# Altium project AnalogAndPWM.PrjPcb
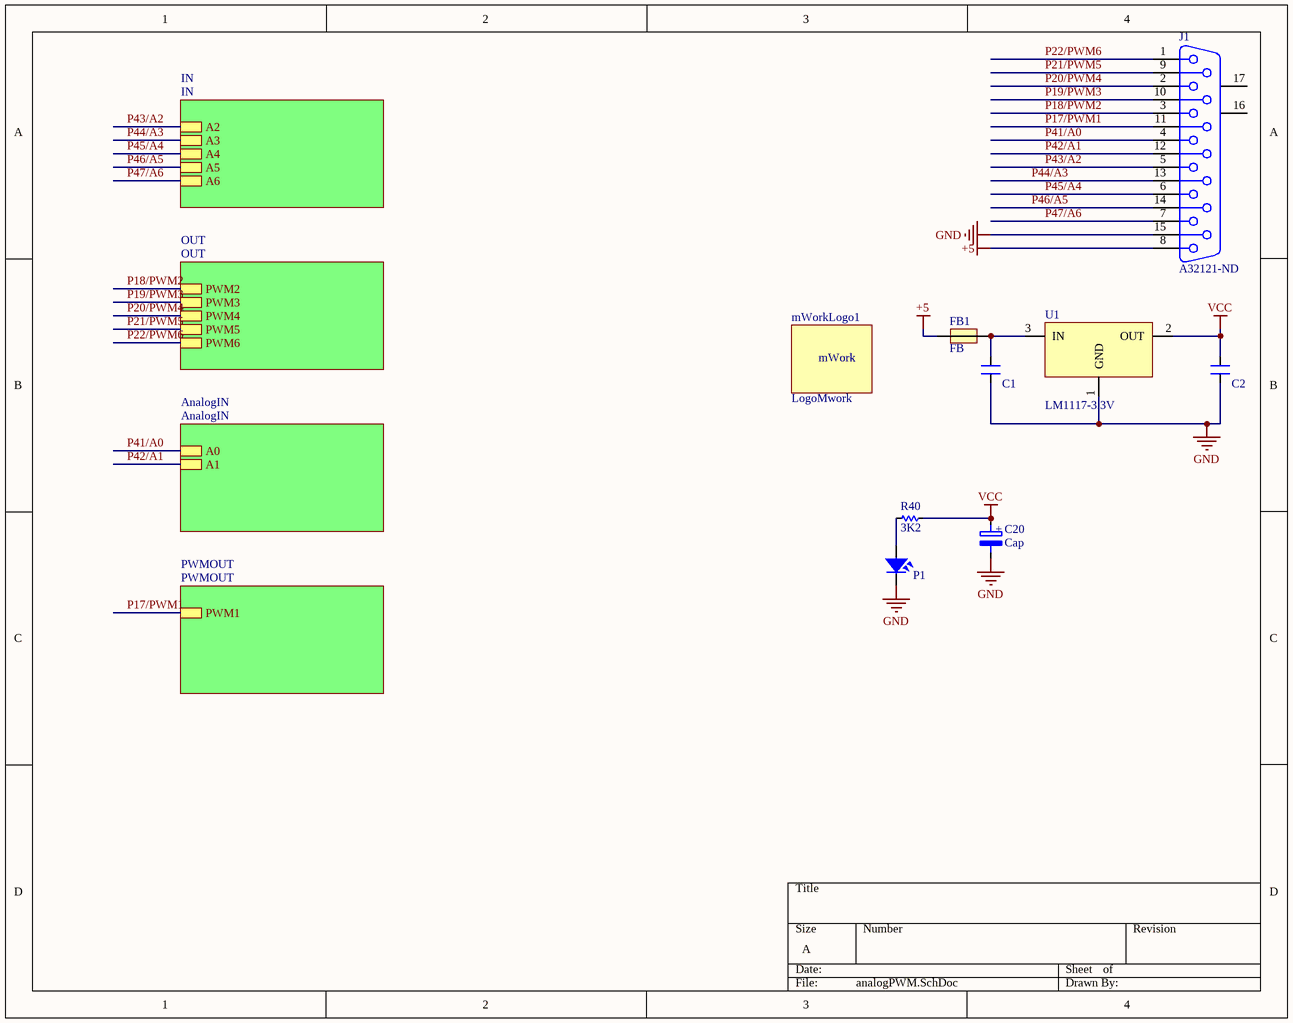
[diagram p0: analogPWM.SchDoc]
5 sheets, 107 parts. Net scope: hierarchical (ports join the sheet entries above them; power ports are global).
Board file: ioPWM.PcbDoc
Sheets:
  analogPWM.SchDoc
    OUT = OUT.SchDoc
    IN = IN.SchDoc
    AnalogIN = AnalogIN.SchDoc
    PWMOUT = PWMOUT.SchDoc

## Sheet analogPWM.SchDoc
size A

### Parts
C1  100nF  [CN-SMD-0805]  (value not drawn)
C2  100nF  [CN-SMD-0805]  (value not drawn)
C20  Cap  [Cap_C]
FB1  FB  [Capacitor_805]
J1  A32121-ND  [DB15]
mWorkLogo1  LogoMwork  [LogoMwork15*6]
P1  LED  [LED-0805-Green]  (value not drawn)
R40  3K2  [RES-SMD-0805]
U1  LM1117-3.3V  [SOT223]

### Sub-sheets
AnalogIN = AnalogIN: A0, A1
IN = IN: A2, A3, A4, A5, A6
OUT = OUT: PWM2, PWM3, PWM4, PWM6, PWM5
PWMOUT = PWMOUT: PWM1

### Nets
+5: FB1.1 J1.8
GND: C1.2 C2.2 C20.2 J1.15 P1.2 U1.1(GND)
VCC: C2.1 C20.1 R40.1 U1.2(OUT)
P17/PWM1: J1.11 ; sheet PWMOUT/PWM1
P18/PWM2: J1.3 ; sheet OUT/PWM2
P19/PWM3: J1.10 ; sheet OUT/PWM3
P20/PWM4: J1.2 ; sheet OUT/PWM4
P21/PWM5: J1.9 ; sheet OUT/PWM5
P22/PWM6: J1.1 ; sheet OUT/PWM6
P41/A0: J1.4 ; sheet AnalogIN/A0
P42/A1: J1.12 ; sheet AnalogIN/A1
P43/A2: J1.5 ; sheet IN/A2
P44/A3: J1.13 ; sheet IN/A3
P45/A4: J1.6 ; sheet IN/A4
P46/A5: J1.14 ; sheet IN/A5
P47/A6: J1.7 ; sheet IN/A6
NetC1_1: C1.1 FB1.2 U1.3(IN)
NetP1_1: P1.1 R40.2

Not connected (* = marked no-connect by the designer): J1 16(MH1) 17(MH2)

### Notes on the sheet
- (in symbol Cap_tan) +
- (in symbol LogoMwork) mWork

### Library data of the parts
C1 C2 = CN: Value: 33pF
C20 = Cap_tan: Polarized Capacitor (Radial)
J1 = DB15: Receptacle Assembly, 15 Position, Right Angle; PackageDocument: O; Positions: 15; Published: 15-Jun-2001; LatestRevisionDate: 17-Jul-2002; LatestRevisionNote: Re-released for DXP Platform.; DatasheetDocument: 1-Sep-99; PackageReference: 788757; Publisher: Altium Limited; Orientation: Right Angle; Gender: Receptacle
P1 = LED SMD: Value: LED 3 - 5 ly 2 Colour
R40 = R
U1 = LM1117: 800mA Low-Dropout Linear Regulator; Creator: Nguyen Ba Bien; Website: http://group3i.net

## Sheet OUT.SchDoc
size A
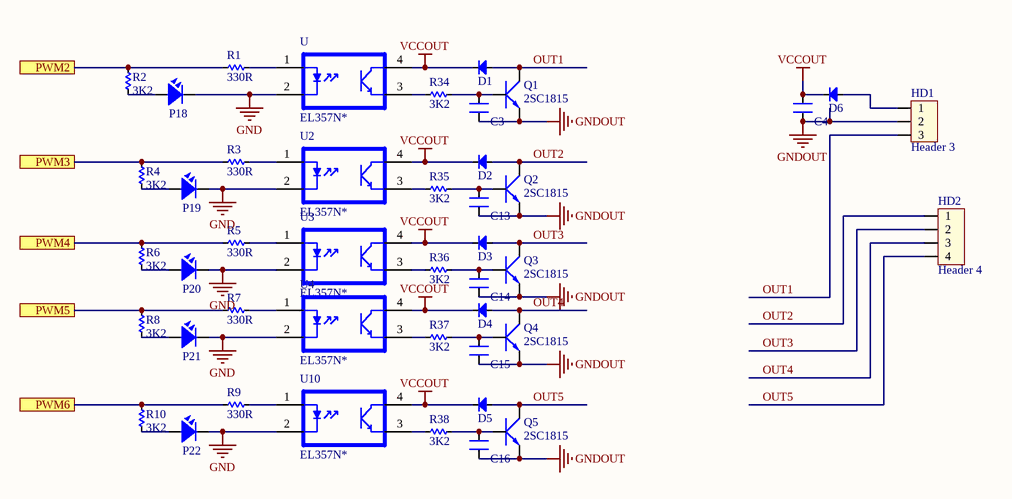
[diagram p1: OUT.SchDoc]

### Parts
C3  100nF  [CN-SMD-0805]  (value not drawn)
C4  100nF  [CN-SMD-0805]  (value not drawn)
C13  100nF  [CN-SMD-0805]  (value not drawn)
C14  100nF  [CN-SMD-0805]  (value not drawn)
C15  100nF  [CN-SMD-0805]  (value not drawn)
C16  100nF  [CN-SMD-0805]  (value not drawn)
D1  Diode  [DIO-SMD-123]  (value not drawn)
D2  Diode  [DIO-SMD-123]  (value not drawn)
D3  Diode  [DIO-SMD-123]  (value not drawn)
D4  Diode  [DIO-SMD-123]  (value not drawn)
D5  Diode  [DIO-SMD-123]  (value not drawn)
D6  Diode  [DIO-SMD-123]  (value not drawn)
HD1  Header 3  [HED3T]
HD2  Header 4  [HED4T]
P18  LED  [LED-0805-Green]  (value not drawn)
P19  LED  [LED-0805-Green]  (value not drawn)
P20  LED  [LED-0805-Green]  (value not drawn)
P21  LED  [LED-0805-Green]  (value not drawn)
P22  LED  [LED-0805-Green]  (value not drawn)
Q1  2SC1815  [SOT23-321]
Q2  2SC1815  [SOT23-321]
Q3  2SC1815  [SOT23-321]
Q4  2SC1815  [SOT23-321]
Q5  2SC1815  [SOT23-321]
R1  330R  [RES-SMD-0805]
R2  3K2  [RES-SMD-0805]
R3  330R  [RES-SMD-0805]
R4  3K2  [RES-SMD-0805]
R5  330R  [RES-SMD-0805]
R6  3K2  [RES-SMD-0805]
R7  330R  [RES-SMD-0805]
R8  3K2  [RES-SMD-0805]
R9  330R  [RES-SMD-0805]
R10  3K2  [RES-SMD-0805]
R34  3K2  [RES-SMD-0805]
R35  3K2  [RES-SMD-0805]
R36  3K2  [RES-SMD-0805]
R37  3K2  [RES-SMD-0805]
R38  3K2  [RES-SMD-0805]
U  EL357N*  [SOP4N]
U2  EL357N*  [SOP4N]
U3  EL357N*  [SOP4N]
U4  EL357N*  [SOP4N]
U10  EL357N*  [SOP4N]

### Ports
PWM2, PWM3, PWM4, PWM5, PWM6

### Nets
GND: P18.2 P19.2 P20.2 P21.2 P22.2 U.2(K) U2.2(K) U3.2(K) U4.2(K) U10.2(K)
GNDOUT: C3.2 C4.2 C13.2 C14.2 C15.2 C16.2 HD1.2 Q1.1(E) Q2.1(E) Q3.1(E) Q4.1(E) Q5.1(E)
VCCOUT: C4.1 D1.2(K) D2.2(K) D3.2(K) D4.2(K) D5.2(K) D6.2(K) U.4(C) U2.4(C) U3.4(C) U4.4(C) U10.4(C)
OUT1: D1.1(A) HD1.3 Q1.2(C)
OUT2: D2.1(A) HD2.1 Q2.2(C)
OUT3: D3.1(A) HD2.2 Q3.2(C)
OUT4: D4.1(A) HD2.3 Q4.2(C)
OUT5: D5.1(A) HD2.4 Q5.2(C)
P18/PWM2: R1.1 R2.1 ; port PWM2
P19/PWM3: R3.1 R4.1 ; port PWM3
P20/PWM4: R5.1 R6.1 ; port PWM4
P21/PWM5: R7.1 R8.1 ; port PWM5
P22/PWM6: R9.1 R10.1 ; port PWM6
NetC3_1: C3.1 Q1.3(B) R34.2
NetC13_1: C13.1 Q2.3(B) R35.2
NetC14_1: C14.1 Q3.3(B) R36.2
NetC15_1: C15.1 Q4.3(B) R37.2
NetC16_1: C16.1 Q5.3(B) R38.2
NetD6_1: D6.1(A) HD1.1
NetP18_1: P18.1 R2.2
NetP19_1: P19.1 R4.2
NetP20_1: P20.1 R6.2
NetP21_1: P21.1 R8.2
NetP22_1: P22.1 R10.2
NetR1_2: R1.2 U.1(A)
NetR3_2: R3.2 U2.1(A)
NetR5_2: R5.2 U3.1(A)
NetR7_2: R7.2 U4.1(A)
NetR9_2: R9.2 U10.1(A)
NetR34_1: R34.1 U.3(E)
NetR35_1: R35.1 U2.3(E)
NetR36_1: R36.1 U3.3(E)
NetR37_1: R37.1 U4.3(E)
NetR38_1: R38.1 U10.3(E)

### Library data of the parts
C3 C4 C13-C16 = CN: Value: 33pF
D1-D6 = Diode: Default Diode; Code - JEDEC: DO-214-AB; Value: 1N5007; Published: 8-Jun-2000; Revision: July-2002: Re-released for DXP Platform.; Publisher: Altium Limited; ComponentLink1Description: ES1J - STMBL; ComponentLink1URL: https://banlinhkien.vn/goods-8089-es1j-do214-diode-1a-600v-sma-es1j-.html
HD1 = Hed3: Header 3 (Green); Value: Header 3
HD2 = Hed4: Header 4 (Green); Value: Header 4
P18-P22 = LED SMD: Value: LED 3 - 5 ly 2 Colour
Q1-Q5 = 2SC1815: NPN 600mW, ECB; Value: C1815
R1-R10 R34-R38 = R
U U2-U4 U10 = EL357N(A)(TA)-G: Optoisolator Transistor Output 3750Vrms 1 Channel 4-SOP _2.54mm_; MP: EL357N_A__TA_-G; MF: Everlight Electronics; Package: SOP-4 Everlight; Availability: Unavailable; SnapEDA_Link: https://www.snapeda.com/parts/EL357N%28A%29%28TA%29-G/Everlight%20Electronics%20Co%20Ltd/view-part/579256/?ref=snap; Price: None; Value: *

## Sheet IN.SchDoc
size A
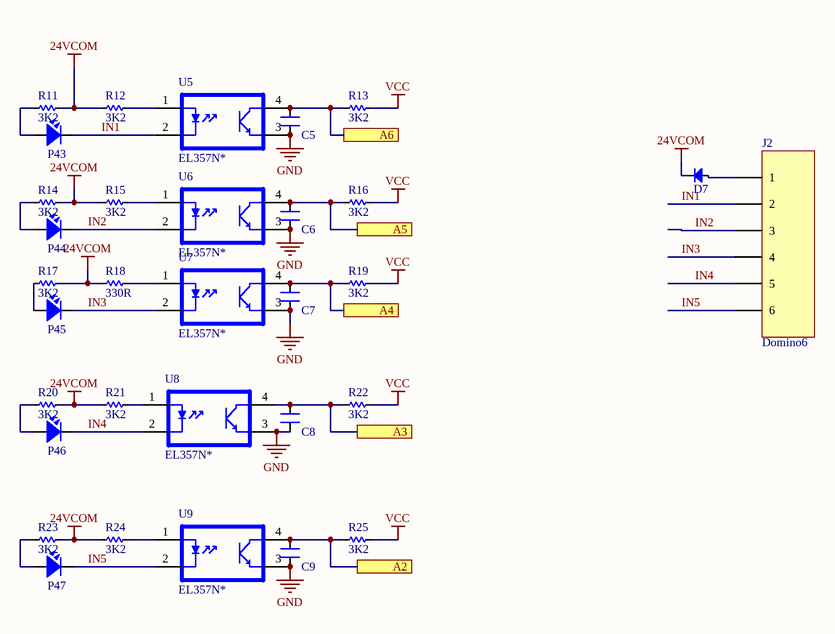
[diagram p2: IN.SchDoc]

### Parts
C5  100nF  [CN-SMD-0805]  (value not drawn)
C6  100nF  [CN-SMD-0805]  (value not drawn)
C7  100nF  [CN-SMD-0805]  (value not drawn)
C8  100nF  [CN-SMD-0805]  (value not drawn)
C9  100nF  [CN-SMD-0805]  (value not drawn)
D7  Diode  [DIO-SMD-123]  (value not drawn)
J2  Domino6  [KF6-5.08T]
P43  LED  [LED-0805-Green]  (value not drawn)
P44  LED  [LED-0805-Green]  (value not drawn)
P45  LED  [LED-0805-Green]  (value not drawn)
P46  LED  [LED-0805-Green]  (value not drawn)
P47  LED  [LED-0805-Green]  (value not drawn)
R11  3K2  [RES-SMD-0805]
R12  3K2  [RES-SMD-0805]
R13  3K2  [RES-SMD-0805]
R14  3K2  [RES-SMD-0805]
R15  3K2  [RES-SMD-0805]
R16  3K2  [RES-SMD-0805]
R17  3K2  [RES-SMD-0805]
R18  330R  [RES-SMD-0805]
R19  3K2  [RES-SMD-0805]
R20  3K2  [RES-SMD-0805]
R21  3K2  [RES-SMD-0805]
R22  3K2  [RES-SMD-0805]
R23  3K2  [RES-SMD-0805]
R24  3K2  [RES-SMD-0805]
R25  3K2  [RES-SMD-0805]
U5  EL357N*  [SOP4N]
U6  EL357N*  [SOP4N]
U7  EL357N*  [SOP4N]
U8  EL357N*  [SOP4N]
U9  EL357N*  [SOP4N]

### Ports
A2, A3, A4, A5, A6

### Nets
24VCOM: D7.2(K) R11.1 R12.1 R14.1 R15.1 R17.1 R18.1 R20.1 R21.1 R23.1 R24.1
GND: C5.2 C6.2 C7.2 C8.2 C9.2 U5.3(E) U6.3(E) U7.3(E) U8.3(E) U9.3(E)
VCC: R13.2 R16.2 R19.2 R22.2 R25.2
IN1: J2.2 P43.2 U5.2(K)
IN2: J2.3 P44.2 U6.2(K)
IN3: J2.4 P45.2 U7.2(K)
IN4: J2.5 P46.2 U8.2(K)
IN5: J2.6 P47.2 U9.2(K)
P43/A2: C9.1 R25.1 U9.4(C) ; port A2
P44/A3: C8.1 R22.1 U8.4(C) ; port A3
P45/A4: C7.1 R19.1 U7.4(C) ; port A4
P46/A5: C6.1 R16.1 U6.4(C) ; port A5
P47/A6: C5.1 R13.1 U5.4(C) ; port A6
NetD7_1: D7.1(A) J2.1
NetP43_1: P43.1 R11.2
NetP44_1: P44.1 R14.2
NetP45_1: P45.1 R17.2
NetP46_1: P46.1 R20.2
NetP47_1: P47.1 R23.2
NetR12_2: R12.2 U5.1(A)
NetR15_2: R15.2 U6.1(A)
NetR18_2: R18.2 U7.1(A)
NetR21_2: R21.2 U8.1(A)
NetR24_2: R24.2 U9.1(A)

### Library data of the parts
C5-C9 = CN: Value: 33pF
D7 = Diode: as D1 on sheet OUT; Published: 8-Jun-2000; Revision: July-2002: Re-released for DXP Platform.; Publisher: Altium Limited; ComponentLink1Description: ES1J - STMBL; ComponentLink1URL: https://banlinhkien.vn/goods-8089-es1j-do214-diode-1a-600v-sma-es1j-.html
J2 = Domino6: Manufacturer: W¨¹rth Elektronik eiSos GmbH; PartNo: 691133710006; ComponentLink1 Description: Manufacturer; ComponentLink2 Description: Datasheet; NoPins: 6; ComponentLink1 URL: http://www.we-online.com; ComponentLink2 URL: http://katalog.we-online.de/em/datasheet/6911337100xx.pdf; Created By: Baojun Chen; Created Date: 4-Aug-15
P43-P47 = LED SMD: Value: LED 3 - 5 ly 2 Colour
R11-R25 = R
U5-U9 = EL357N(A)(TA)-G: as U on sheet OUT; Package: SOP-4 Everlight; Availability: Unavailable; SnapEDA_Link: https://www.snapeda.com/parts/EL357N%28A%29%28TA%29-G/Everlight%20Electronics%20Co%20Ltd/view-part/579256/?ref=snap; Price: None; Value: *

## Sheet AnalogIN.SchDoc
size A
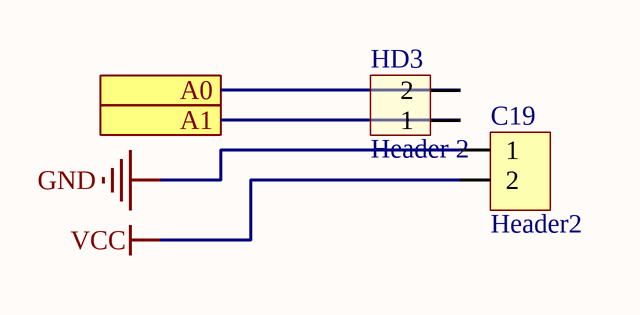
[diagram p3: AnalogIN.SchDoc]

### Parts
C19  Header2  [HDR2]
HD3  Header 2  [HED2T]

### Ports
A0, A1

### Nets
GND: C19.1
VCC: C19.2
P41/A0: HD3.2 ; port A0
P42/A1: HD3.1 ; port A1

### Library data of the parts
C19 = Header2: Header IDC, 2 x 1 Pin Vertical 2.54mm Pitch (Non-Boxed, Male); Manufacturer: W¨¹rth Elektronik eiSos GmbH; partNo: 613002143121; ComponentLink1 Description: Manufacturer; ComponentLink2 Description: Datasheet; NoPins: 02; Created Date: 29 March 2013; ComponentLink1URL: http://www.we-online.com; ComponentLink2URL: http://katalog.we-online.de/em/datasheet/6130xx143121.pdf; Created by: Karrer Zheng
HD3 = Hed2: Header 2 (Green); Value: Header 2

## Sheet PWMOUT.SchDoc
size A
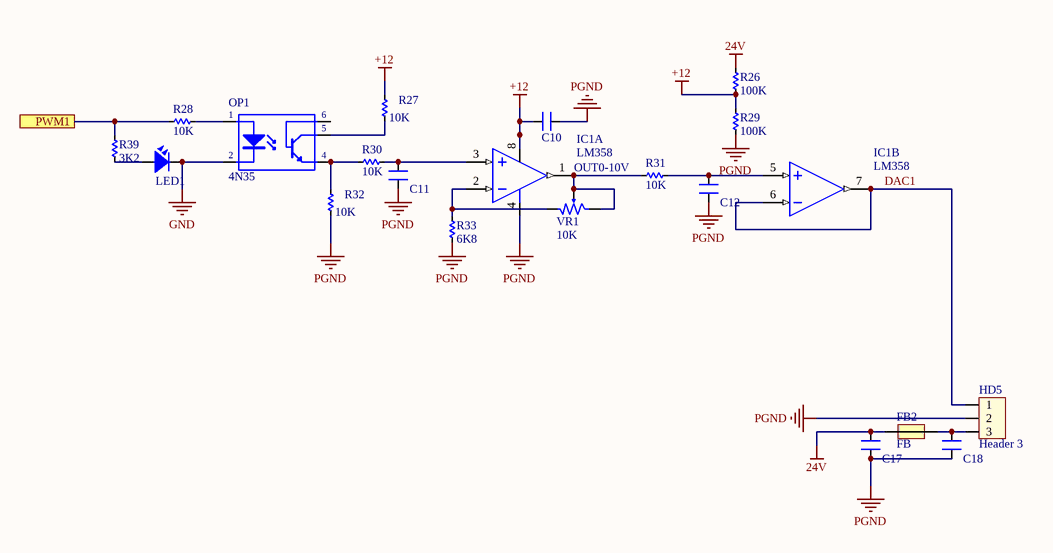
[diagram p4: PWMOUT.SchDoc]

### Parts
C10  100nF  [CN-SMD-0805]  (value not drawn)
C11  100nF  [CN-SMD-0805]  (value not drawn)
C12  100nF  [CN-SMD-0805]  (value not drawn)
C17  CN  [CN-SMD-0805]  (value not drawn)
C18  CN  [CN-SMD-0805]  (value not drawn)
FB2  FB  [Capacitor_805]
HD5  Header 3  [HED3T]
IC1  LM358  [DIP8/W0.3]  (parts A,B of 2)
LED1  LED  [LED-0805-Green]  (value not drawn)
OP1  4N35  [DIP6]
R26  100K  [RES-SMD-0805]
R27  10K  [RES-SMD-0805]
R28  10K  [RES-SMD-0805]
R29  100K  [RES-SMD-0805]
R30  10K  [RES-SMD-0805]
R31  10K  [RES-SMD-0805]
R32  10K  [RES-SMD-0805]
R33  6K8  [RES-SMD-0805]
R39  3K2  [RES-SMD-0805]
VR1  10K  [VR1]

### Ports
PWM1

### Nets
24V: C17.2 FB2.2 R26.2
+12: C10.2 IC1.8(+V) R26.1 R27.1 R29.1
GND: LED1.2 OP1.2(K)
PGND: C10.1 C11.2 C12.2 C17.1 C18.1 HD5.2 IC1.4(-V) R29.2 R32.2 R33.2
DAC1: HD5.1 IC1.6(IN-) IC1.7(OUT)
P17/PWM1: R28.1 R39.1 ; port PWM1
NetC11_1: C11.1 IC1.3(IN+) R30.2
NetC12_1: C12.1 IC1.5(IN+) R31.2
NetC18_2: C18.2 FB2.1 HD5.3
NetIC1_1: IC1.1(OUT) R31.1 VR1.2 VR1.3
NetIC1_2: IC1.2(IN-) R33.1 VR1.1
NetLED1_1: LED1.1 R39.2
NetOP1_1: OP1.1(A) R28.2
NetOP1_4: OP1.4(E) R30.1 R32.1
NetOP1_5: OP1.5(C) R27.2

Not connected (* = marked no-connect by the designer): OP1 6(C)

### Notes on the sheet
- OUT0-10V

### Library data of the parts
C10-C12 C17 C18 = CN: Value: 33pF
HD5 = Hed3: Header 3 (Green); Value: Header 3
IC1 = LM358: Low-Power Dual Operational Amplifier; Value: LM358
LED1 = LED SMD: Value: LED 3 - 5 ly 2 Colour
OP1 = 4N35: Opto; Value: 4N35
R26-R33 R39 = R
VR1 = VR1: Var Resistor; Value: VR 10K

## Nets that join several sheets
GND: analogPWM (6 pins), OUT (10 pins), IN (10 pins), AnalogIN (C19.1), PWMOUT (LED1.2 OP1.2)
VCC: analogPWM (C2.1 C20.1 R40.1 U1.2), IN (5 pins), AnalogIN (C19.2)
P17/PWM1: analogPWM (J1.11), PWMOUT (R28.1 R39.1)
P18/PWM2: analogPWM (J1.3), OUT (R1.1 R2.1)
P19/PWM3: analogPWM (J1.10), OUT (R3.1 R4.1)
P20/PWM4: analogPWM (J1.2), OUT (R5.1 R6.1)
P21/PWM5: analogPWM (J1.9), OUT (R7.1 R8.1)
P22/PWM6: analogPWM (J1.1), OUT (R9.1 R10.1)
P41/A0: analogPWM (J1.4), AnalogIN (HD3.2)
P42/A1: analogPWM (J1.12), AnalogIN (HD3.1)
P43/A2: analogPWM (J1.5), IN (C9.1 R25.1 U9.4)
P44/A3: analogPWM (J1.13), IN (C8.1 R22.1 U8.4)
P45/A4: analogPWM (J1.6), IN (C7.1 R19.1 U7.4)
P46/A5: analogPWM (J1.14), IN (C6.1 R16.1 U6.4)
P47/A6: analogPWM (J1.7), IN (C5.1 R13.1 U5.4)